# Altium project TinyFir_PCB.PrjPcb
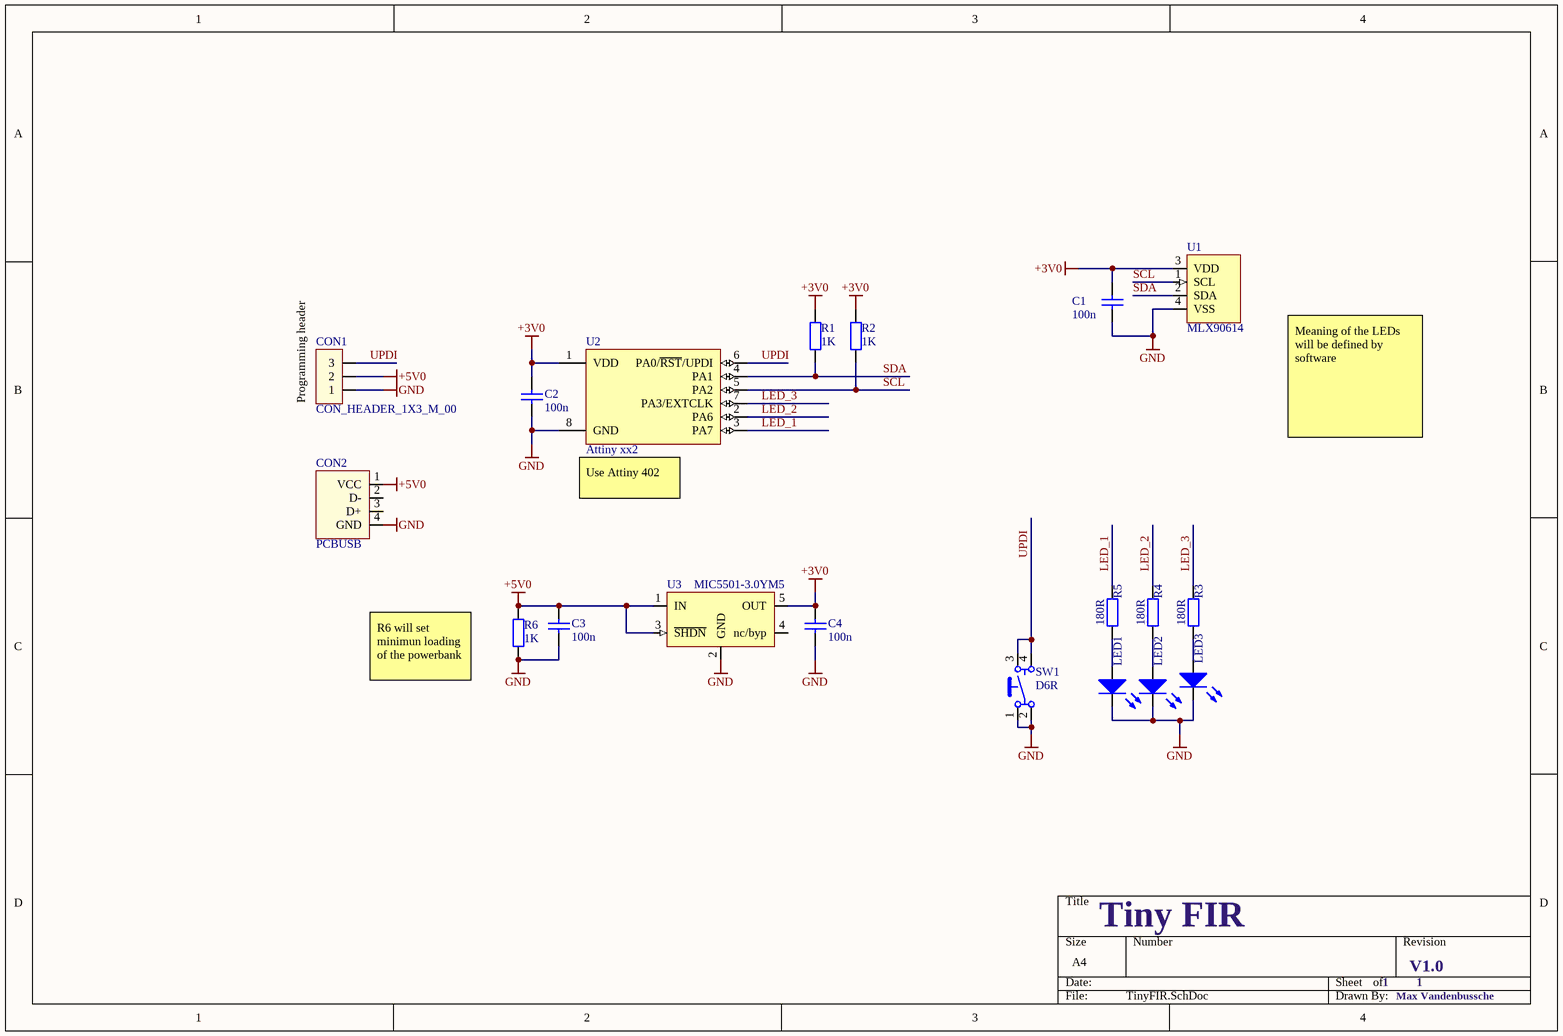
[diagram p0: TinyFIR.SchDoc]
1 sheet, 19 parts. Net scope: global (net labels, ports and power ports of the same name join across sheets).
Board file: TinyFIR.PcbDoc

## Sheet TinyFIR.SchDoc
size A4

### Parts
C1  100n  [CAPC1608[0603]N]
C2  100n  [CAPC1608[0603]N]
C3  100n  [CAPC1608[0603]N]
C4  100n  [CAPC1608[0603]N]
CON1  CON_HEADER_1X3_M_00  [CON_HEADER_1X3_M_00]
CON2  PCBUSB  [PCB_USB]
LED1  KP-2012SRC  [DIO2012[0805]]  (value not drawn)
LED2  KP-2012SYC  [DIO2012[0805]]  (value not drawn)
LED3  KP-2012MGC  [DIO2012[0805]]  (value not drawn)
R1  1K  [RESC1608[0603]N]
R2  1K  [RESC1608[0603]N]
R3  180R  [RESC1608[0603]N]
R4  180R  [RESC1608[0603]N]
R5  180R  [RESC1608[0603]N]
R6  1K  [RESC1608[0603]N]
SW1  D6R  [SW_SPST_PB_CK]
U1  MLX90614  [MLX90614_**C]
U2  Attiny xx2  [SOIC127P600-8_straight]
U3  MIC5501-3.0YM5  [SOT23-5]

### Nets
+3V0: C1.2 C2.2 C4.2 R1.2 R2.2 U1.3(VDD) U2.1(VDD) U3.5(OUT)
+5V0: C3.2 CON1.2 CON2.1(VCC) R6.2 U3.1(IN) U3.3(~{SHDN})
GND: C1.1 C2.1 C3.1 C4.1 CON1.1 CON2.4(GND) LED1.1(K) LED2.1(K) LED3.1(K) R6.1 SW1.1(A) SW1.2(B) U1.4(VSS) U2.8(GND) U3.2(GND)
LED_1: R5.2 U2.3(PA7)
LED_2: R4.2 U2.2(PA6)
LED_3: R3.2 U2.7(PA3/EXTCLK)
SCL: R2.1 U1.1(SCL) U2.5(PA2)
SDA: R1.1 U1.2(SDA) U2.4(PA1)
UPDI: CON1.3 SW1.3(C) SW1.4(D) U2.6(PA0/~{RST}/UPDI)
NetLED1_2: LED1.2(A) R5.1
NetLED2_2: LED2.2(A) R4.1
NetLED3_2: LED3.2(A) R3.1

Not connected (* = marked no-connect by the designer): CON2 2(D-) 3(D+); U3 4(nc/byp)

### Notes on the sheet
- (near CON1) Programming header
- Meaning of the LEDs will be defined by software
- (near U2) Use Attiny 402
- (near R6) R6 will set minimun loading of the powerbank
- Tiny FIR
- 1
- V1.0
- Max Vandenbussche

### Library data of the parts
C1-C4 = CAPC_100n_0603: CAPACITOR Ceramic Multi-Layer X7R; 100nF; 50V; 0603; Tolerance, +/-10%; Temp, op. -55°C to +125°C; Manufacturer: Samsung; Manufacturer P/N: CL10B104KBNC; Value: 100000p; CIN: 121-100-067; AMOUNT: 1.000; Fast Track: Yes; Delivery-XPEQT: No; Published: 2007-07-31; ComponentLink1Description: Datasheet [PDF]; Publisher: PDS; ComponentLink1URL: http://cvs.tess.elex.be/cgi-bin/cvsweb/~checkout~/business_units/technology_development/HW_Groups/datasheets/Capacitors/SMD_Ceramic/smccp.pdf?rev=1.1; Voltage: 50V; MLX P/N: CAPC_100n_0603; Supplier 1: Comet Electronics; Supplier Part Number 1: C0603 100nF 50V X7R SAMSUNG; FMEA_TYPE: CAPACITOR
CON1 = CON_HEADER_1X3_M_00: Header, 1x3 pins, pitch 2.54mm, Male, Straight; CIN: 142-200-388; AMOUNT: 1.000; Delivery-XPEQT: No; FMEA_TYPE: CONNECTOR; ComponentLink1Description: Datasheet [PDF]; ComponentLink1URL: http://cvs.tess.elex.be/cgi-bin/cvsweb/business_units/technology_development/HW_Groups/datasheets/connectors/HEADER_SIL_M_00_FCI.pdf?rev=1.1; Published: 2007-10-03; Publisher: SLE; MLX P/N: CON_HEADER_1X3_M_00; Manufacturer: *; Manufacturer P/N: *; Supplier 1: *; Supplier Part Number 1: *; Fast Track: No
CON2 = CON_USB_A_PCB: USB A PCB connector; Manufacturer: Amphenol; Manufacturer P/N: 10103594-0001LF; MLX P/N: CON_USB_MICRO_B_90; Published: 2018/03; Publisher: GDI; Supplier 1: Farnell; Supplier Part Number 1: 2293752
LED1 = KP-2012SRC: LED SMD 0805 super bright red clear; CIN: 153-300-024; AMOUNT: 1.000; Delivery-XPEQT: No; Published: 2008-04-03; Publisher: Altium/vso; ComponentLink1Description: Datasheet [PDF]; ComponentLink1URL: http://cvs.tess.elex.be/cgi-bin/cvsweb/~checkout~/business_units/technology_development/HW_Groups/datasheets/semiconductors/SMD-LED_Kingbright_KP2012x.pdf?rev=1.1; MLX P/N: KP-2012SRC; Manufacturer: *; Manufacturer P/N: *; Supplier 1: *; Supplier Part Number 1: *; Fast Track: No; FMEA_TYPE: LED
LED2 = KP-2012SYC: LED SMD 0805 super bright yellow clear; CIN: 153-300-025; AMOUNT: 1.000; Delivery-XPEQT: No; Published: 2008-04-03; Publisher: Altium/vso; ComponentLink1Description: Datasheet [PDF]; ComponentLink1URL: http://cvs.tess.elex.be/cgi-bin/cvsweb/~checkout~/business_units/technology_development/HW_Groups/datasheets/semiconductors/SMD-LED_Kingbright_KP2012x.pdf?rev=1.1; MLX P/N: KP-2012SYC; Manufacturer: *; Manufacturer P/N: *; Supplier 1: *; Supplier Part Number 1: *; Fast Track: No; FMEA_TYPE: LED
LED3 = KP-2012MGC: LED SMD 0805 mega green clear; CIN: 153-300-026; AMOUNT: 1.000; Delivery-XPEQT: No; Published: 2008-04-03; Publisher: Altium/vso; ComponentLink1Description: Datasheet [PDF]; ComponentLink1URL: http://cvs.tess.elex.be/cgi-bin/cvsweb/~checkout~/business_units/technology_development/HW_Groups/datasheets/semiconductors/SMD-LED_Kingbright_KP-2012MGC.pdf?rev=1.1; MLX P/N: KP-2012MGC; Manufacturer: *; Manufacturer P/N: *; Supplier 1: *; Supplier Part Number 1: *; Fast Track: No; FMEA_TYPE: LED
R1 R2 R6 = RESC_1K_0603: Resistor Thick Film; 1K; 0603; 0.1W; 1%; 50V; 100ppm/DegC; Value: 1000R; CIN: 122-110-174; AMOUNT: 1.000; Delivery-XPEQT: No; Published: 2008-04-17; Publisher: PDS; ComponentLink1Description: Datasheet [PDF]; ComponentLink1URL: http://cvs.tess.elex.be/cgi-bin/cvsweb/~checkout~/business_units/technology_development/HW_Groups/datasheets/Resistors/SMD/SMD_Resistors.pdf?rev=1.1; Tolerance: 1%; MLX P/N: RESC_1K_0603; Supplier 1: Comet Electronics; Supplier Part Number 1: R0603 1.0K 1%; Fast Track: No; FMEA_TYPE: RESISTOR
R3-R5 = RESC_180R_0603: Resistor Thick Film; 180R; 0603; 0.1W; 1%; 50V; 100ppm/DegC; CIN: 122-110-440; AMOUNT: 1.000; Delivery-XPEQT: No; Fast Track: Yes; Published: 2008-04-17; Publisher: PDS; ComponentLink1Description: Datasheet [PDF]; ComponentLink1URL: http://cvs.tess.elex.be/cgi-bin/cvsweb/~checkout~/business_units/technology_development/HW_Groups/datasheets/Resistors/SMD/SMD_Resistors.pdf?rev=1.1; Value: 180R; Tolerance: 1%; MLX P/N: RESC_180R_0603; Manufacturer: *; Manufacturer P/N: *; Supplier 1: *; Supplier Part Number 1: *; FMEA_TYPE: RESISTOR
SW1 = SW_SPST_PB_L: SPST Momentary Key Switches; Manufacturer: TE connectivity; Manufacturer P/N: 1825910-7; Published: 2018/03; Publisher: GDI
U1 = MLX90614: MLX90614 Infra Red Thermometer in TO-39; MLX P/N: MLX90621; Published: 2018/03; Publisher: GDI
U2 = Attiny_xy2: AVR® Microcontroller with Core Independent Peripherals / and picoPower® Technology
U3 = MCP1801T-1202I/OT: Voltage Regulator, FIxed LDO, Vo=+3V, Io=300mA, SOT23-5; Manufacturer: MICROCHIP; AMOUNT: 1.000; CIN: 112-160-146; MLX_Device: Fandriver; Delivery-XPEQT: No; FMEA_TYPE: IC; Published: 2019-04-18; Publisher: DTL; ComponentLink1Description: Datasheet [PDF]; ComponentLink1URL: https://gitlab.melexis.com/tcc-hardware/HW_Templates_Altium/AD_Datasheets/blob/master/MLX_Devices/MCP1801.pdf; MLX P/N: MCP1801T-1202I/OT; Manufacturer P/N: MCP1801T-1202I/OT; Supplier 1: Farnell; Supplier Part Number 1: 1851980; Fast Track: No

## Assembly variants
NoProgHeader: not fitted C2 C4 CON1 CON2 R6